# Altium schematic sheet DSI_LCD.SchDoc: DSI LCD
size A4; Date: Not used; ApprovedBy: Not used; CheckedBy: Not used; Author: Not used; CompanyName: STMicroelectronics; DrawnBy: Not used; Engineer: Not used; Organization: Not used; Address1: Not used; Address2: Not used; Address3: Not used; Address4: Not used; DocumentNumber: Not used; Revision: Not used; SheetNumber: 10; SheetTotal: 16; CurrentTime: Not used; CurrentDate: Not used; Time: Not used; DocumentFullPathAndName: Not used; DocumentName: Not used; ModifiedDate: Not used; ImagePath: Not used; ProjectName: Not used; Application_BuildNumber: Not used
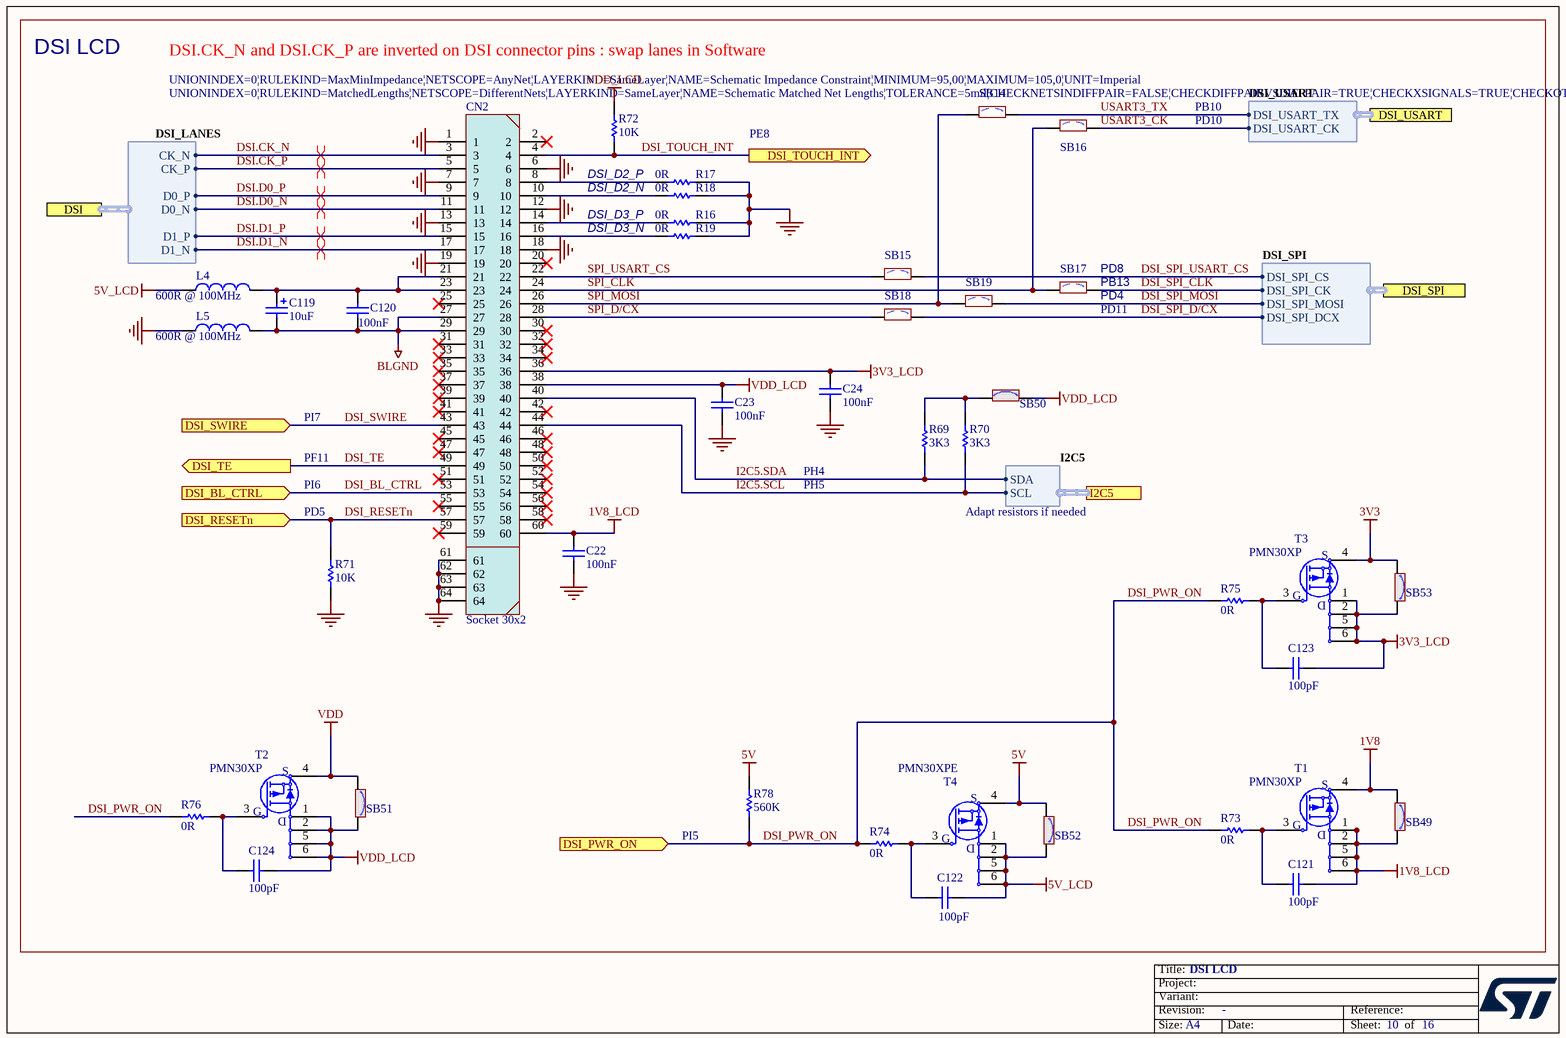
[diagram p0: DSI_LCD.SchDoc]

## Parts
C22  value 100nF  [C0402]  (hidden comment: Capacitor)
C23  value 100nF  [C0402]  (hidden comment: Capacitor)
C24  value 100nF  [C0402]  (hidden comment: Capacitor)
C119  value 10uF  [CPOL_TAJ-A_1206_H180]  (hidden comment: Cap_POL_TANA)
C120  value 100nF  [C0402]  (hidden comment: Capacitor)
C121  value 100pF  [C0603]  (hidden comment: Capacitor)
C122  value 100pF  [C0603]  (hidden comment: Capacitor)
C123  value 100pF  [C0603]  (hidden comment: Capacitor)
C124  value 100pF  [C0603]  (hidden comment: Capacitor)
CN2  value Socket 30x2  [CON_SAMTEC_QSH-030-01-F-D-A_no-LCD-MB1835]  (hidden comment: Socket QSH-030-01-F-D-A_DSI_LCD)
L4  value 600R @ 100MHz  [L0603]  (hidden comment: BEAD)
L5  value 600R @ 100MHz  [L0603]  (hidden comment: BEAD)
R16  value 0R  [R0402]  (hidden comment: Resistor)
R17  value 0R  [R0402]  (hidden comment: Resistor)
R18  value 0R  [R0402]  (hidden comment: Resistor)
R19  value 0R  [R0402]  (hidden comment: Resistor)
R69  value 3K3  [R0402]  (hidden comment: Resistor)
R70  value 3K3  [R0402]  (hidden comment: Resistor)
R71  value 10K  [R0402]  (hidden comment: Resistor)
R72  value 10K  [R0402]  (hidden comment: Resistor)
R73  value 0R  [R0603]  (hidden comment: Resistor)
R74  value 0R  [R0603]  (hidden comment: Resistor)
R75  value 0R  [R0603]  (hidden comment: Resistor)
R76  value 0R  [R0603]  (hidden comment: Resistor)
R78  value 560K  [R0402]  (hidden comment: Resistor)
SB14  SB_OFF  [SOLDER-BRIDGE_R0402-0R]  (value not drawn)
SB15  SB_OFF  [SOLDER-BRIDGE_R0402-0R]  (value not drawn)
SB16  SB_OFF  [SOLDER-BRIDGE_R0402-0R]  (value not drawn)
SB17  SB_OFF  [SOLDER-BRIDGE_R0402-0R]  (value not drawn)
SB18  SB_OFF  [SOLDER-BRIDGE_R0402-0R]  (value not drawn)
SB19  SB_OFF  [SOLDER-BRIDGE_R0402-0R]  (value not drawn)
SB49  SB_ON  [SOLDER-BRIDGE_R0402-0R]  (value not drawn)
SB50  SB_ON  [SOLDER-BRIDGE_R0402-0R]  (value not drawn)
SB51  SB_ON  [SOLDER-BRIDGE_R0402-0R]  (value not drawn)
SB52  SB_ON  [SOLDER-BRIDGE_R0402-0R]  (value not drawn)
SB53  SB_ON  [SOLDER-BRIDGE_R0402-0R]  (value not drawn)
T1  PMN30XP  [MOS_SOT23-6L]
T2  PMN30XP  [MOS_SOT23-6L]
T3  PMN30XP  [MOS_SOT23-6L]
T4  value PMN30XPE  [MOS_SOT23-6L]  (hidden comment: PMN30XP)

## Ports
DSI (harness DSI_LANES), DSI_BL_CTRL (in), DSI_PWR_ON (in), DSI_RESETn (in), DSI_SPI (harness DSI_SPI), DSI_SWIRE (in), DSI_TE (out), DSI_TOUCH_INT (out), DSI_USART (harness DSI_USART), I2C5 (harness I2C5)

## Harnesses
I2C5: SDA, SCL
DSI_USART: DSI_USART_CK, DSI_USART_TX
DSI_SPI: DSI_SPI_CS, DSI_SPI_MOSI, DSI_SPI_CK, DSI_SPI_DCX
DSI_LANES: CK_P, CK_N, D0_P, D0_N, D1_N, D1_P

## Nets
1V8: SB49.1 T1.4(S)
1V8_LCD: C22.2 C121.2 CN2.60 SB49.2 T1.1(S) T1.2(S) T1.5(D) T1.6(D)
3V3: SB53.1 T3.4(S)
3V3_LCD: C24.2 C123.2 CN2.36 SB53.2 T3.1(S) T3.2(S) T3.5(D) T3.6(D)
5V: R78.2 SB52.1 T4.4(S)
5V_LCD: C122.2 L4.1 SB52.2 T4.1(S) T4.2(S) T4.5(D) T4.6(D)
BLGND: C119.2 C120.1 CN2.27 CN2.29 L5.2
GND: C22.1 C23.1 C24.1 CN2.1 CN2.6 CN2.7 CN2.12 CN2.13 CN2.18 CN2.19 CN2.61 CN2.62 CN2.63 CN2.64 L5.1 R16.2 R17.2 R18.2 R19.2 R71.1
VDD: SB51.1 T2.4(S)
VDD_LCD: C23.2 C124.2 CN2.38 R72.2 SB50.2 SB51.2 T2.1(S) T2.2(S) T2.5(D) T2.6(D)
DSI.CK_N: CN2.3 ; port DSI.CK_N
DSI.CK_P: CN2.5 ; port DSI.CK_P
DSI.D0_N: CN2.11 ; port DSI.D0_N
DSI.D0_P: CN2.9 ; port DSI.D0_P
DSI.D1_N: CN2.17 ; port DSI.D1_N
DSI.D1_P: CN2.15 ; port DSI.D1_P
DSI_BL_CTRL: CN2.53 ; port DSI_BL_CTRL
DSI_PWR_ON: R73.1 R74.1 R75.1 R76.1 R78.1 ; port DSI_PWR_ON
DSI_RESETn: CN2.57 R71.2 ; port DSI_RESETn
DSI_SPI_CLK: SB17.2 ; port DSI_SPI.DSI_SPI_CK
DSI_SPI_D/CX: SB18.2 ; port DSI_SPI.DSI_SPI_DCX
DSI_SPI_MOSI: SB19.2 ; port DSI_SPI.DSI_SPI_MOSI
DSI_SPI_USART_CS: SB15.2 ; port DSI_SPI.DSI_SPI_CS
DSI_SWIRE: CN2.43 ; port DSI_SWIRE
DSI_TE: CN2.49 ; port DSI_TE
DSI_TOUCH_INT: CN2.4 R72.1 ; port DSI_TOUCH_INT
I2C5.SCL: CN2.44 R70.2 ; port I2C5.SCL
I2C5.SDA: CN2.40 R69.2 ; port I2C5.SDA
SPI_CLK: CN2.24 SB16.1 SB17.1
SPI_D/CX: CN2.28 SB18.1
SPI_MOSI: CN2.26 SB14.1 SB19.1
SPI_USART_CS: CN2.22 SB15.1
USART3_CK: SB16.2 ; port DSI_USART.DSI_USART_CK
USART3_TX: SB14.2 ; port DSI_USART.DSI_USART_TX
NetC119_1: C119.1 C120.2 CN2.21 CN2.23 L4.2
NetC121_1: C121.1 R73.2 T1.3(G)
NetC122_1: C122.1 R74.2 T4.3(G)
NetC123_1: C123.1 R75.2 T3.3(G)
NetC124_1: C124.1 R76.2 T2.3(G)
NetCN2_8: CN2.8 R17.1
NetCN2_10: CN2.10 R18.1
NetCN2_14: CN2.14 R16.1
NetCN2_16: CN2.16 R19.1
NetR69_1: R69.1 R70.1 SB50.1

Not connected (* = marked no-connect by the designer): CN2 2* 20* 25* 30* 31* 32* 33* 34* 35* 37* 39* 41* 42* 45* 46* 47* 48* 50* 51* 52* 54* 55* 56* 58* 59*

## Layout directives
differential pair; rule Impedance Constraint [Min = 95.00    Max = 105.0    ]; rule Matched Net Lengths [Tolerance = 5mil]: DSI.CK_N
differential pair; rule Impedance Constraint [Min = 95.00    Max = 105.0    ]; rule Matched Net Lengths [Tolerance = 0mil]: DSI.CK_P, DSI.D0_N, DSI.D0_P, DSI.D1_N, DSI.D1_P

## Notes on the sheet
- DSI LCD
- DSI.CK_N and DSI.CK_P are inverted on DSI connector pins : swap lanes in Software
- PB10
- DSI_D2_P
- PE8
- PD10
- DSI_D2_N
- DSI_D3_P
- DSI_D3_N
- (near SB17) PD11
- (near SB17) PD4
- (near SB17) PD8
- (near SB17) PB13
- PI7
- PI6
- PF11
- (near R71) PD5
- PH5
- PH4
- Adapt resistors if needed
- (near R78) PI5
- Title:
- Project:
- Size:
- Revision:
- Variant:
- A4
- -
- Date:
- Reference:
- Sheet:
- of

## Library data of the parts
C22-C24 C120 = MCD-00006: Capacitor, MLCC, 100nF, 16V, X7R, +/-10%, 0402, T=0.5mm; Manufacturer_Part_Number: CC0402KRX7R7BB104; Manufacturer: YAGEO; Part_Preference: Recommended; Order_Code_RS: 616-9701; Component_Country_Of_Origin: China; Internal_Part_Number: MCD-00006; Status: Released; Part_Type: Capacitor; Package: 0402; ComponentLink1URL: http://tunmcdsvn.tun.st.com/Component_Documentation_Library/Trunk/Capacitor/YAGEO_X7R_Series; Order_Code_Digikey: 311-1338-1-ND; Order_Code_Farnell: 9402047
C119 = MCD-00199: Capacitor, Tantalum, 10uF, 16V, 3R, +/-10%, Type_A (3216 metric), T=1.6mm; Manufacturer_Part_Number: TAJA106K016R; Manufacturer: AVX; BMS_Part_Number: 9141044; Part_Preference: Recommended; Order_Code_RS: 699-2848; Component_Country_Of_Origin: El Salvador; Revision: July-2002: Re-released for DXP Platform.; Internal_Part_Number: MCD-00199; Status: Checked; Part_Type: Capacitor; Package: 3216 (metric); ComponentLink1URL: http://tunmcdsvn.tun.st.com/Component_Documentation_Library/Trunk/Capacitor/AVX_TAJ_Series; Order_Code_Digikey: 478-1655-1-ND; Order_Code_Farnell: 1432339
C121-C124 = MCD-01101: Capacitor, MLCC, 100pF, 50V, X7R, +/-5%, 0603, T=0.33mm; Manufacturer_Part_Number: 06035C101JAT4A; Manufacturer: AVX; Part_Preference: Recommended; Component_Country_Of_Origin: China; Internal_Part_Number: MCD-01101; Status: Checked; Part_Type: Capacitor; Package: 0603; ComponentLink1URL: http://tunmcdsvn.tun.st.com/Component_Documentation_Library/Trunk/Capacitor/AVX_X7R_Series; Order_Code_Digikey: 06035C101JAT4A-ND; Order_Code_Farnell: 2332634; Order_Code_RS: N/A
CN2 = MCD-02128: Socket, 30x2, 0.5mm, VR, SMD, T=3.05mm; Part_Type: Connector; Manufacturer: SAMTEC; Part_Preference: Recommended; Order_Code_RS: 180-2587; Component_Country_Of_Origin: China, Costa Rica, Malaysia, United States, Vietnam; Internal_Part_Number: MCD-02128; Status: Checked; Manufacturer_Part_Number: QSH-030-01-F-D-A; ComponentLink1URL: http://tunmcdsvn.tun.st.com/Component_Documentation_Library/Trunk/Connector/SAMTEC_QSH_Series/; Order_Code_Digikey: SAM13214TR-ND; Order_Code_Farnell: N/A
L4 L5 = MCD-00047: Ferrite bead, 600R @1 00MHz, +/-25%, 350mA, 0R5, 0603, T=0.8mm; Part_Type: Inductor; Manufacturer_Part_Number: FCM1608KF-601T03; Manufacturer: TAI-TECH; Part_Preference: Recommended; Component_Country_Of_Origin: Unknown; Internal_Part_Number: MCD-00047; Status: Released; ComponentLink1URL: http://tunmcdsvn.tun.st.com/Component_Documentation_Library/Trunk/Inductor/TAI-TECH_FCM-1608_Series; Package: 0603; Order_Code_Digikey: N/A; Order_Code_Farnell: N/A; Order_Code_RS: N/A
R16-R19 = MCD-00052: Resistor, 0R, 0402, +/-5%, 1/16W; Manufacturer_Part_Number: RC0402JR-070RL; Manufacturer: YAGEO; Part_Preference: Recommended; Order_Code_RS: 618-5804; Component_Country_Of_Origin: China; Internal_Part_Number: MCD-00052; Status: Released; Part_Type: Resistor; Package: 0402; ComponentLink1URL: http://tunmcdsvn.tun.st.com/Component_Documentation_Library/Trunk/Resistor/YAGEO_RC_L_Series; Order_Code_Digikey: 311-0.0JRCT-ND; Order_Code_Farnell: 9232516RL
R69 R70 = MCD-00184: Resistor, 3K3, 0402, +/-1%, 1/16W; BMS_Part_Number: 9131946; Manufacturer: YAGEO; Manufacturer_Part_Number: RC0402FR-073K3L; Part_Preference: Recommended; Component_Country_Of_Origin: China; Internal_Part_Number: MCD-00184; Status: Released; Part_Type: Resistor; Package: 0402; ComponentLink1URL: http://tunmcdsvn.tun.st.com/Component_Documentation_Library/Trunk/Resistor/YAGEO_RC_L_Series; Order_Code_Digikey: 311-3.30KLRCT-ND; Order_Code_Farnell: 9239294; Order_Code_RS: N/A
R71 R72 = MCD-00053: Resistor, 10K, 0402, +/-1%, 1/16W; Manufacturer_Part_Number: RC0402FR-0710KL; Manufacturer: YAGEO; BMS_Part_Number: 9131590; Part_Preference: Recommended; Component_Country_Of_Origin: China; Internal_Part_Number: MCD-00053; Status: Released; Part_Type: Resistor; ComponentLink1URL: http://tunmcdsvn.tun.st.com/Component_Documentation_Library/Trunk/Resistor/YAGEO_RC_L_Series; Package: 0402; Order_Code_Digikey: 311-10.0KLRCT-ND; Order_Code_Farnell: 9239359; Order_Code_RS: N/A
R73-R76 = MCD-00056: Resistor, 0R, 0603, +/-5%, 1/10W; Manufacturer_Part_Number: RC0603JR-070RL; Manufacturer: YAGEO; Part_Preference: Recommended; Component_Country_Of_Origin: China; Internal_Part_Number: MCD-00056; Status: Released; Part_Type: Resistor; Package: 0603; ComponentLink1URL: http://tunmcdsvn.tun.st.com/Component_Documentation_Library/Trunk/Resistor/YAGEO_RC_L_Series; Order_Code_Digikey: 311-0.0GRCT-ND; Order_Code_Farnell: 9233130RL; Order_Code_RS: N/A
R78 = MCD-00495: Resistor, 560K, 0402, +/-1%, 1/16W; Manufacturer_Part_Number: RC0402FR-07560KL; Manufacturer: YAGEO; Part_Preference: Recommended; Component_Country_Of_Origin: China; ShowFields: YES; ID: 2779; Internal_Part_Number: MCD-00495; Status: Released; Part_Type: Resistor; Package: 0402; ComponentLink1URL: http://tunmcdsvn.tun.st.com/Component_Documentation_Library/Trunk/Resistor/YAGEO_RC_L_Series; Order_Code_Digikey: 311-560KLRCT-ND; Order_Code_Farnell: 1458810; Order_Code_RS: N/A
SB14-SB19 = MCD-02162: Solder Bridge 0402 OFF; Part_Type: Misc; Manufacturer_Part_Number: RC0402JR-070RL; Manufacturer: YAGEO; Part_Preference: Recommended; Order_Code_RS: 618-5804; Component_Country_Of_Origin: China; Internal_Part_Number: MCD-02162; Status: Checked; Package: SB0402; ComponentLink1URL: http://tunmcdsvn.tun.st.com/Component_Datasheet_Library/Trunk/Resistors/Yageo_Resistor_RC0402-series; Order_Code_Digikey: 311-0.0JRTR-ND; Order_Code_Farnell: 2363467
SB49-SB53 = MCD-01618: Solder Bridge 0402 ON; Part_Type: Misc; Manufacturer_Part_Number: RC0402JR-070RL; Manufacturer: YAGEO; Part_Preference: Recommended; Order_Code_RS: 618-5804; Component_Country_Of_Origin: China; Internal_Part_Number: MCD-01618; Status: Released; Package: SB0402; ComponentLink1URL: http://tunmcdsvn.tun.st.com/Component_Datasheet_Library/Trunk/Resistors/Yageo_Resistor_RC0402-series; Order_Code_Digikey: 311-0.0JRTR-ND; Order_Code_Farnell: 2363467
T1-T3 = MCD-01926: 20 V, P-channel Trench MOSFET; Part_Type: IC; Manufacturer_Part_Number: PMN30XPX; Manufacturer: NEXPERIA; Part_Preference: Recommended; Order_Code_RS: 153-0671; Component_Country_Of_Origin: China; Internal_Part_Number: MCD-01926; Value: PMN30XP; Status: Checked; Package: TSOP6; ComponentLink1URL: http://tunmcdsvn.tun.st.com/Component_Datasheet_Library/Trunk/IC/NEXPERIA_P_Channel_MOSFET_PMN30XP; Order_Code_Digikey: 1727-2699-1-ND; Order_Code_Farnell: 2545273
T4 = MCD-03170: Transistor, MOSFET, P-CH, -20V, 7A, SOT457; Part_Preference: Recommended; Manufacturer: NEXPERIA; Partial_Alternate_Internal_Part_Number: MCD-01926; ShowFields: YES; ID: 5286; Component_Country_Of_Origin: China°; Internal_Part_Number: MCD-03170; Status: Checked; Part_Type: Transistor; Manufacturer_Part_Number: PMN30XPE; Package: TSOP6; ComponentLink1URL: http://tunmcdsvn.tun.st.com/Component_Documentation_Library/Trunk/IC/NEXPERIA_PMN30XPE; Order_Code_Digikey: PMN30XPEX-ND; Order_Code_Farnell: 3132376RL; Order_Code_RS: N/A